# EAGLE design untitled (EAGLE 7.5.0)
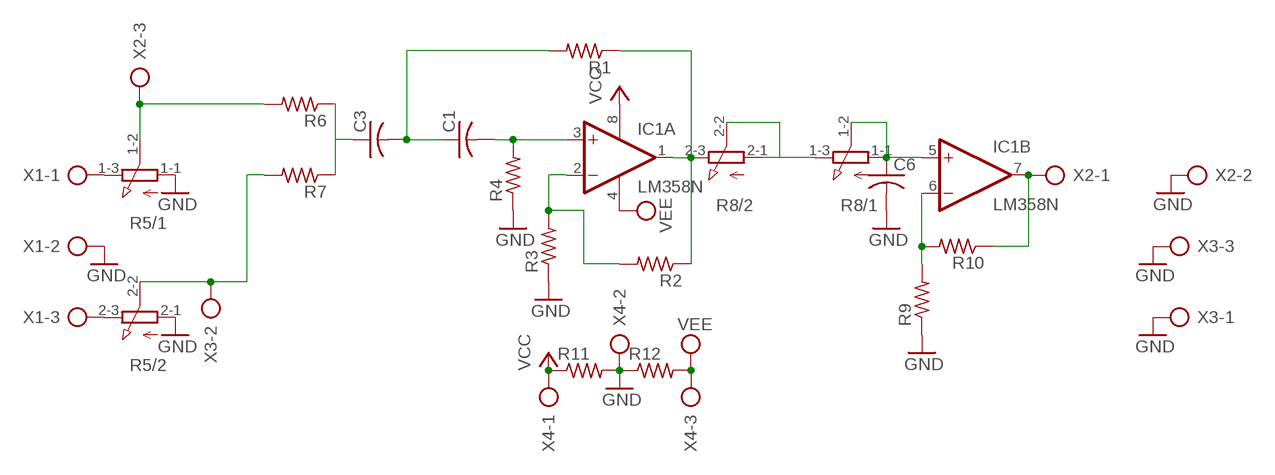
[diagram p0: schematic, sheet 1]

## Parts
C1  C-US025-025X050  [C025-025X050]
C3  C-US025-025X050  [C025-025X050]
C6  C-US025-025X050  [C025-025X050]
IC1  LM358N  [DIL08]
R1  FLIPFLOP-RES  [0805-THM]
R2  FLIPFLOP-RES  [0805-THM]
R3  FLIPFLOP-RES  [0805-THM]
R4  FLIPFLOP-RES  [0805-THM]
R5  3RP/1610G  [3RP/1610G]
R6  FLIPFLOP-RES  [0805-THM]
R7  FLIPFLOP-RES  [0805-THM]
R8  3RP/1610G  [3RP/1610G]
R9  FLIPFLOP-RES  [0805-THM]
R10  FLIPFLOP-RES  [0805-THM]
R11  R-US_0309/10  [0309/10]
R12  R-US_0309/10  [0309/10]
X1  AK300/3  [AK300/3]
X2  AK300/3  [AK300/3]
X3  AK300/3  [AK300/3]
X4  AK300/3  [AK300/3]

## Nets
GND: C6.2 R3.1 R4.1 R5.1-1(/1:A) R5.2-1(/2:A) R9.1 R11.2 R12.1 X1.2 X2.2 X3.1 X3.3 X4.2
N$1: C1.2 IC1.3(A:+IN) R4.2
N$2: C1.1 C3.2 R1.2
N$3: IC1.2(A:-IN) R2.2 R3.2
N$4: IC1.1(A:OUT) R1.1 R2.1 R8.2-3(/2:E)
N$5: R5.1-3(/1:E) X1.1
N$6: R5.2-3(/2:E) X1.3
N$7: C3.1 R6.1 R7.1
N$8: R5.1-2(/1:S) R6.2 X2.3
N$9: R5.2-2(/2:S) R7.2 X3.2
N$10: C6.1 IC1.5(B:+IN) R8.1-1(/1:A) R8.1-2(/1:S)
N$11: R8.1-3(/1:E) R8.2-1(/2:A) R8.2-2(/2:S)
N$12: IC1.6(B:-IN) R9.2 R10.2
N$13: IC1.7(B:OUT) R10.1 X2.1
VCC: IC1.8(P:V+) R11.1 X4.1
VEE: IC1.4(P:V-) R12.2 X4.3

## Library data of the parts
C1 C3 C6 = adafruit:C-US: CAPACITOR, American symbol
IC1 = linear:LM358: OP AMP also LM158; LM258; LM2904 Source: http://cache.national.com/ds/LM/LM158.pdf
R1-R4 R6 R7 R9 R10 = adafruit:FLIPFLOP-RES: Flip Flop resistor An 0805 resistor inside a standard 1/4W 5% resistor. Makes for easy mods
R5 R8 = pot:3RP/1610G: 16mm Potentiometer two level Source: http://www.alphapotentiometers.net/html/16mm_pot_2.html
R11 R12 = adafruit:R-US_: RESISTOR, American symbol
X1-X4 = con-ptr500:AK300/3: CONNECTOR; OC_FARNELL: unknown; OC_NEWARK: unknown

## Board
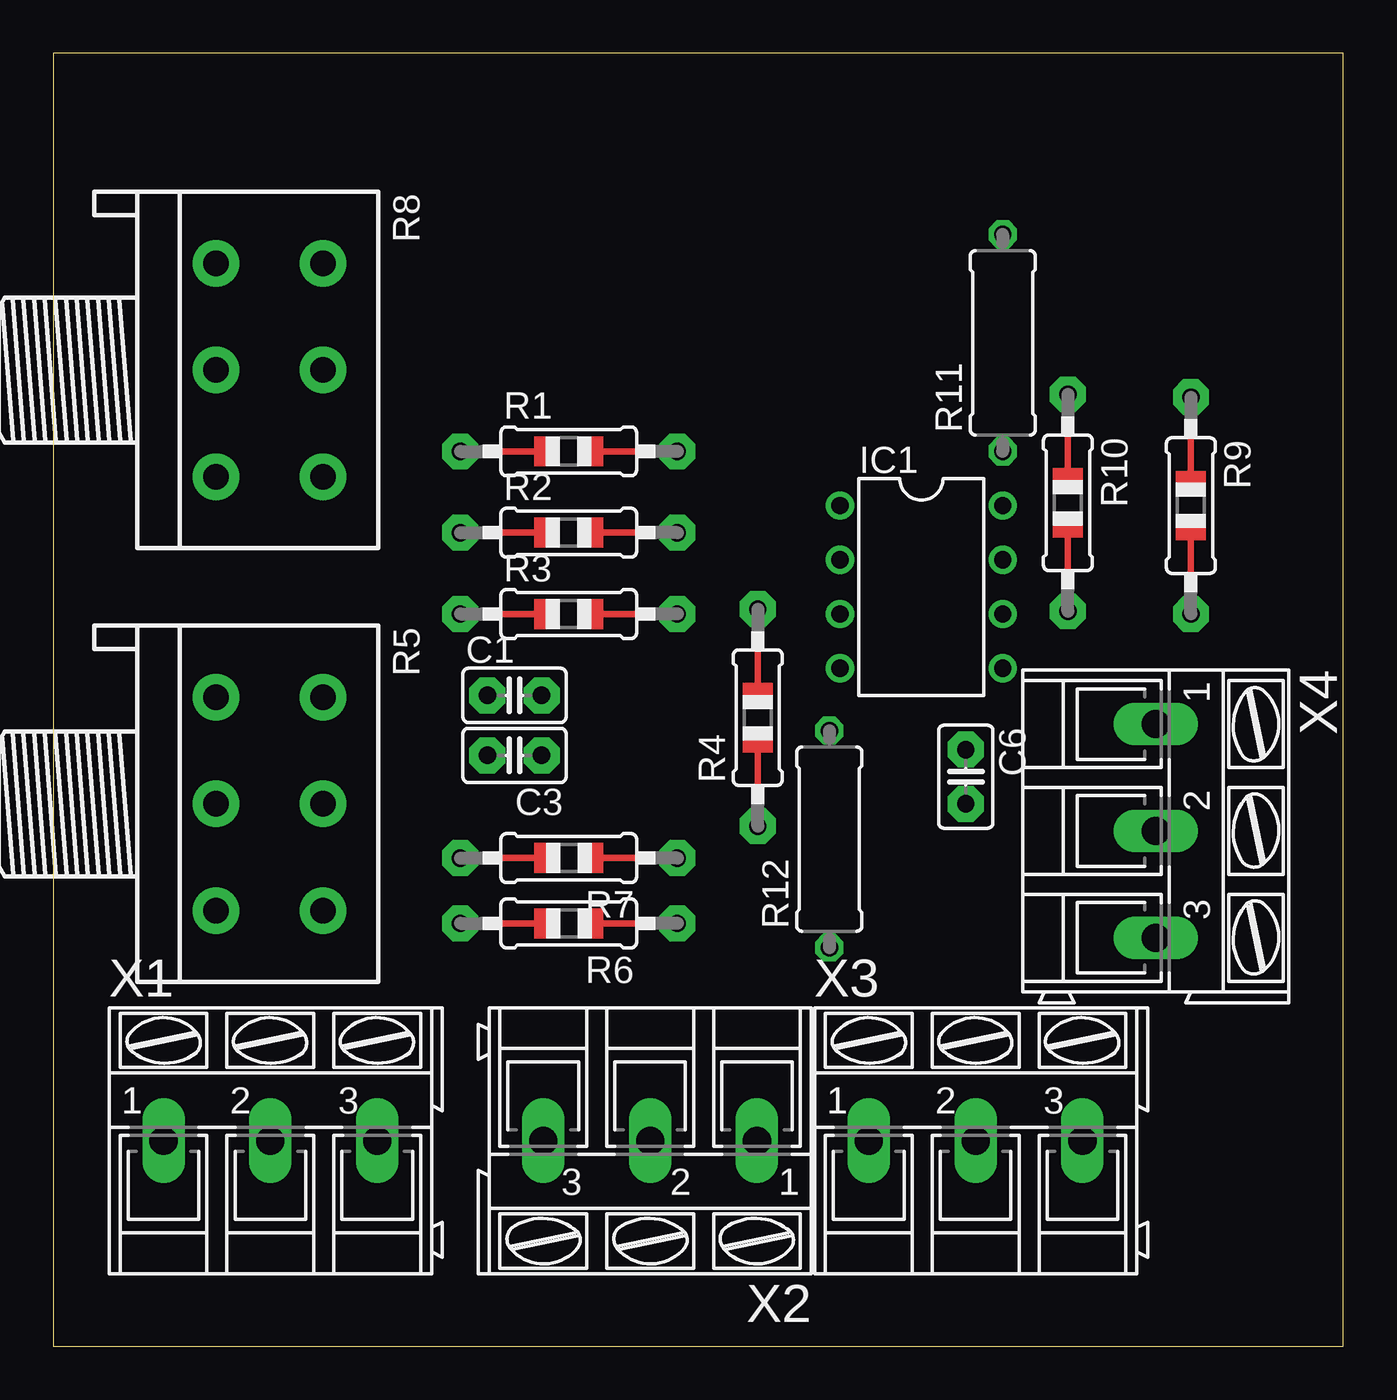
[diagram p1: board, top side]
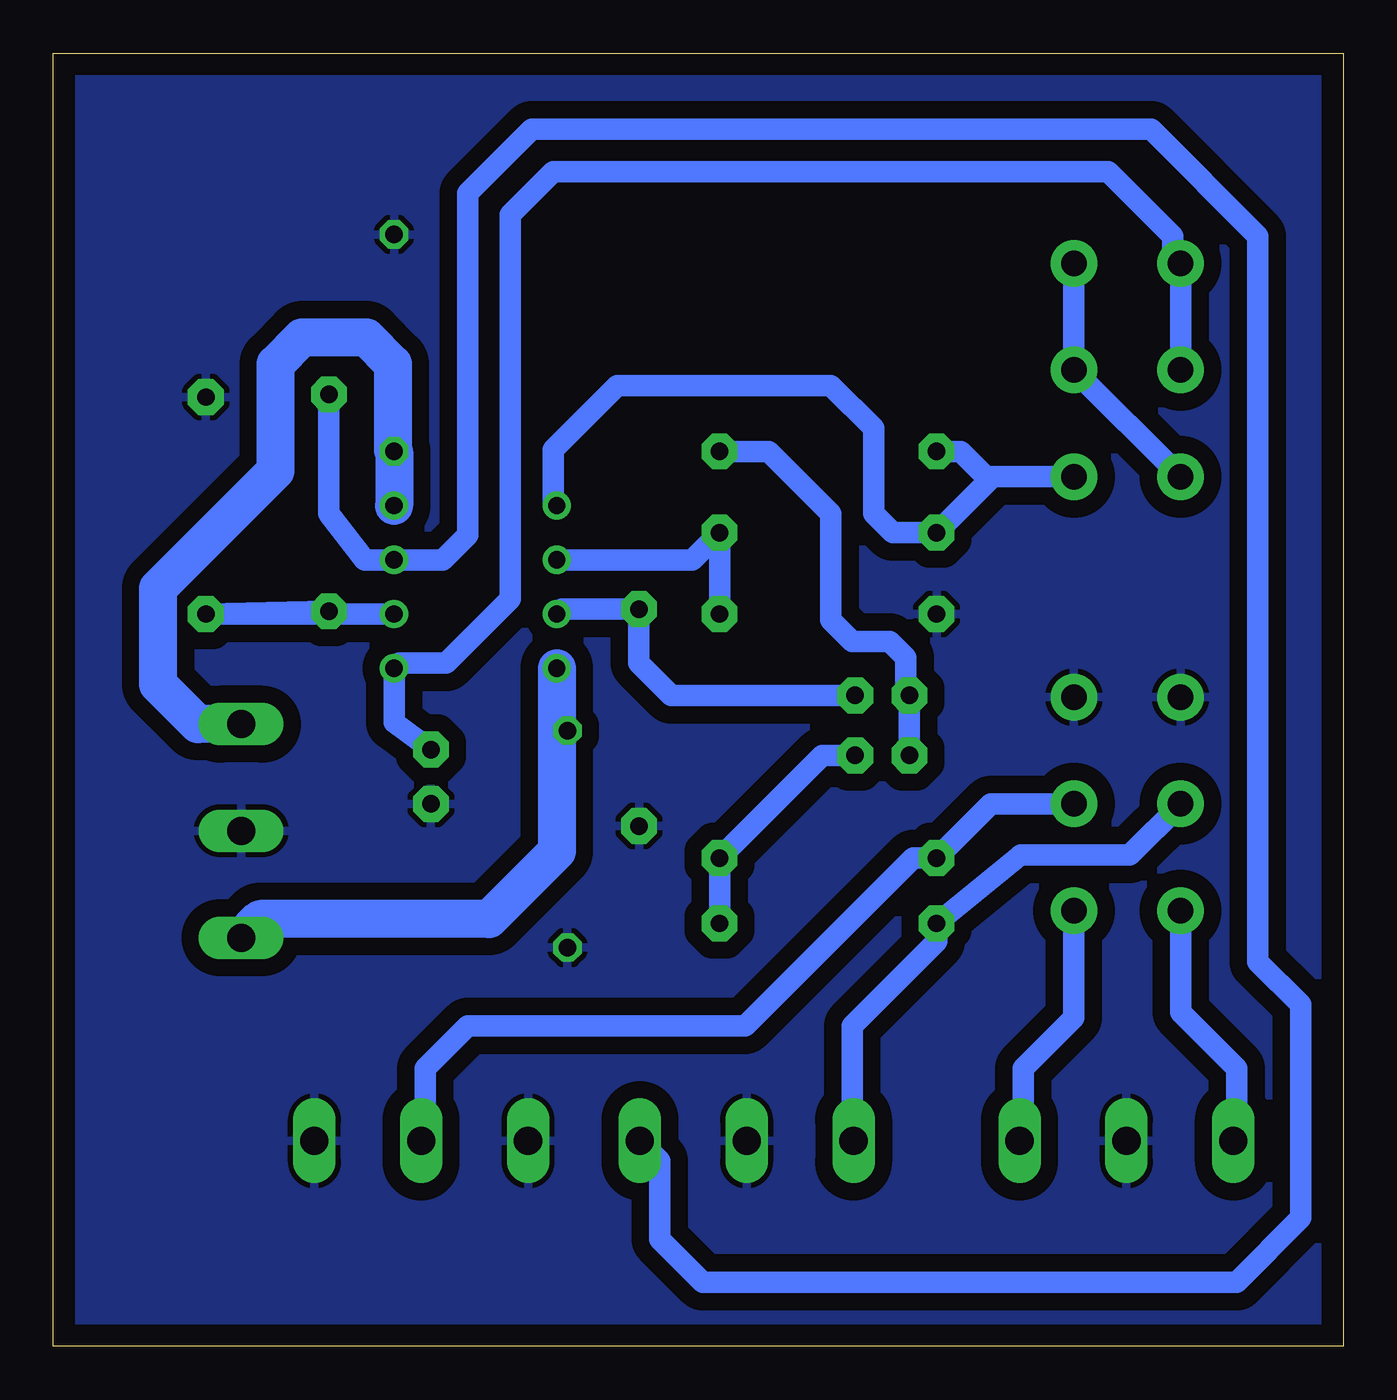
[diagram p2: board, bottom side, seen from below]

Size 60.4 x 60.55 mm. Coordinates in mm from the lower left corner, seen from the top.
Outline: 0,0 60.4,0 60.4,60.55 0,60.55 0,0
Copper layers (1*16): Top 0.035mm / dielectric 1.5mm / Bottom 0.035mm
Design rules "default": minimum track width 10mil, minimum drill 24mil, track to track 8mil, track to pad 8mil, pad to pad 8mil, via to via 8mil, smd to smd 8mil, copper to edge 40mil, drill to drill 8mil, minimum pad ring 10mil, minimum via ring 8mil, stop-mask expansion 4mil, vias tented up to drill 0mil, thermal gap 10mil

### Footprints (pad centres in the part's own frame; a part is rotated, then mirrored left to right if it is on the bottom)
C025-025X050 = drill 0.813 pad 1.676 octagon: 1 -1.27,0; 2 1.27,0
DIL08 = drill 0.813 pad 1.27: 1 -3.81,-3.81; 2 -1.27,-3.81; 3 1.27,-3.81; 4 3.81,-3.81; 5 3.81,3.81; 6 1.27,3.81; 7 -1.27,3.81; 8 -3.81,3.81
0805-THM = drill 0.813 pad 1.676 octagon: 1 -5.08,0; 2 5.08,0
3RP/1610G = drill 1.2 pad 2.184: 1-1 -5,0; 1-2 0,0; 1-3 5,0; 2-1 -5,5; 2-2 0,5; 2-3 5,5
0309/10 = drill 0.813 octagon: 1 -5.08,0; 2 5.08,0
AK300/3 = drill 1.321 long: 1 -5.004,0; 2 0,0; 3 5.004,0

### Placement (x,y rotation side)
C1  21.59,30.48 0 top
C3  21.59,27.67 180 top
C6  42.72,26.67 270 top
IC1  40.64,35.56 270 top
R1  24.13,41.91 0 top
R2  24.13,38.1 0 top
R3  24.13,34.29 0 top
R4  32.98,29.44 90 top
R5  7.62,25.4 270 top
R6  24.13,19.8 180 top
R7  24.13,22.86 180 top
R8  7.62,45.72 270 top
R9  53.26,39.37 270 top
R10  47.5,39.5 270 top
R11  44.45,46.99 90 top
R12  36.33,23.75 90 top
X1  10.16,9.62 0 top
X2  27.94,9.62 180 top
X3  43.18,9.62 0 top
X4  51.61,24.13 270 top

### Tracks (layer width: path | path; a pad name or v marks a point on that pad's centre or on a via)
GND
  pour Bottom (isolate 0.813): 0,60.88 0,0 60.42,0 60.42,60.88
N$1
  Bottom 1.016: C1.2 31.48,30.48 33,32 33,34.5 R4.2 36.6,34.52 IC1.3
N$2
  Bottom 1.016: R1.2 26.91,41.91 24,39 24,34 23,33 21.25,33 20.5,32.25 20.5,30.66 C1.1 C3.2
N$3
  Bottom 1.016: IC1.2 30.48,36.83 R2.2 R3.2
N$4
  Bottom 1.016: R8.2-3 16.43,40.72 16.57,40.58 | 16.57,40.58 R2.1 21.1,38.1 22,39 22,43 24,45 34,45 37,42 37,39.54 IC1.1 | R1.1 17.91,41.91 16.57,40.58
N$5
  Bottom 1.016: R5.1-3 7.62,15.62 5,13 5,9.78 X1.1
N$6
  Bottom 1.016: R5.2-3 12.62,15.38 15,13 15,9.78 X1.3
N$7
  Bottom 1.016: C3.1 24.4,27.67 R7.1 R6.1
N$8
  Bottom 1.016: R5.1-2 7.62,25.38 10,23 15.1,23 R6.2 19.05,18.95 23,15 23,9.68 X2.3
N$9
  Bottom 1.016: R5.2-2 16.51,25.4 R7.2 20.14,22.86 28,15 41,15 43,13 43,9.8 X3.2
N$10
  Bottom 1.016: R8.1-1 R8.1-2 7.62,50.62 8,51 8,52 11,55 37,55 39,53 39,35 42,32 44.2,32 IC1.5 44.45,29.21 C6.1
N$11
  Bottom 1.016: R8.2-1 R8.2-2 R8.1-3
N$12
  Bottom 1.016: IC1.6 R9.2 R10.2
N$13
  Bottom 1.016: R10.1 47.5,39 45.83,36.83 IC1.7 42.17,36.83 41,38 41,54 38,57 9,57 4,52 4,18 2,16 2,6 5,3 30,3 32,5 32,8.68 X2.1
VCC
  Bottom 1.016: 44.5,41.96 R11.1
  Bottom 1.778: X4.1 53.63,29.13 55.5,31 55.5,35.5 50,41 50,46 48.75,47.25 45.75,47.25 44.5,46 44.5,41.96 | R11.1 IC1.8
VEE
  Bottom 1.016: 36.83,29.33 R12.2
  Bottom 1.778: IC1.4 36.83,29.33 36.83,23.17 40,20 50.74,20 X4.3